# EAGLE schematic csa_gecko_v3.0c (EAGLE 4.16)
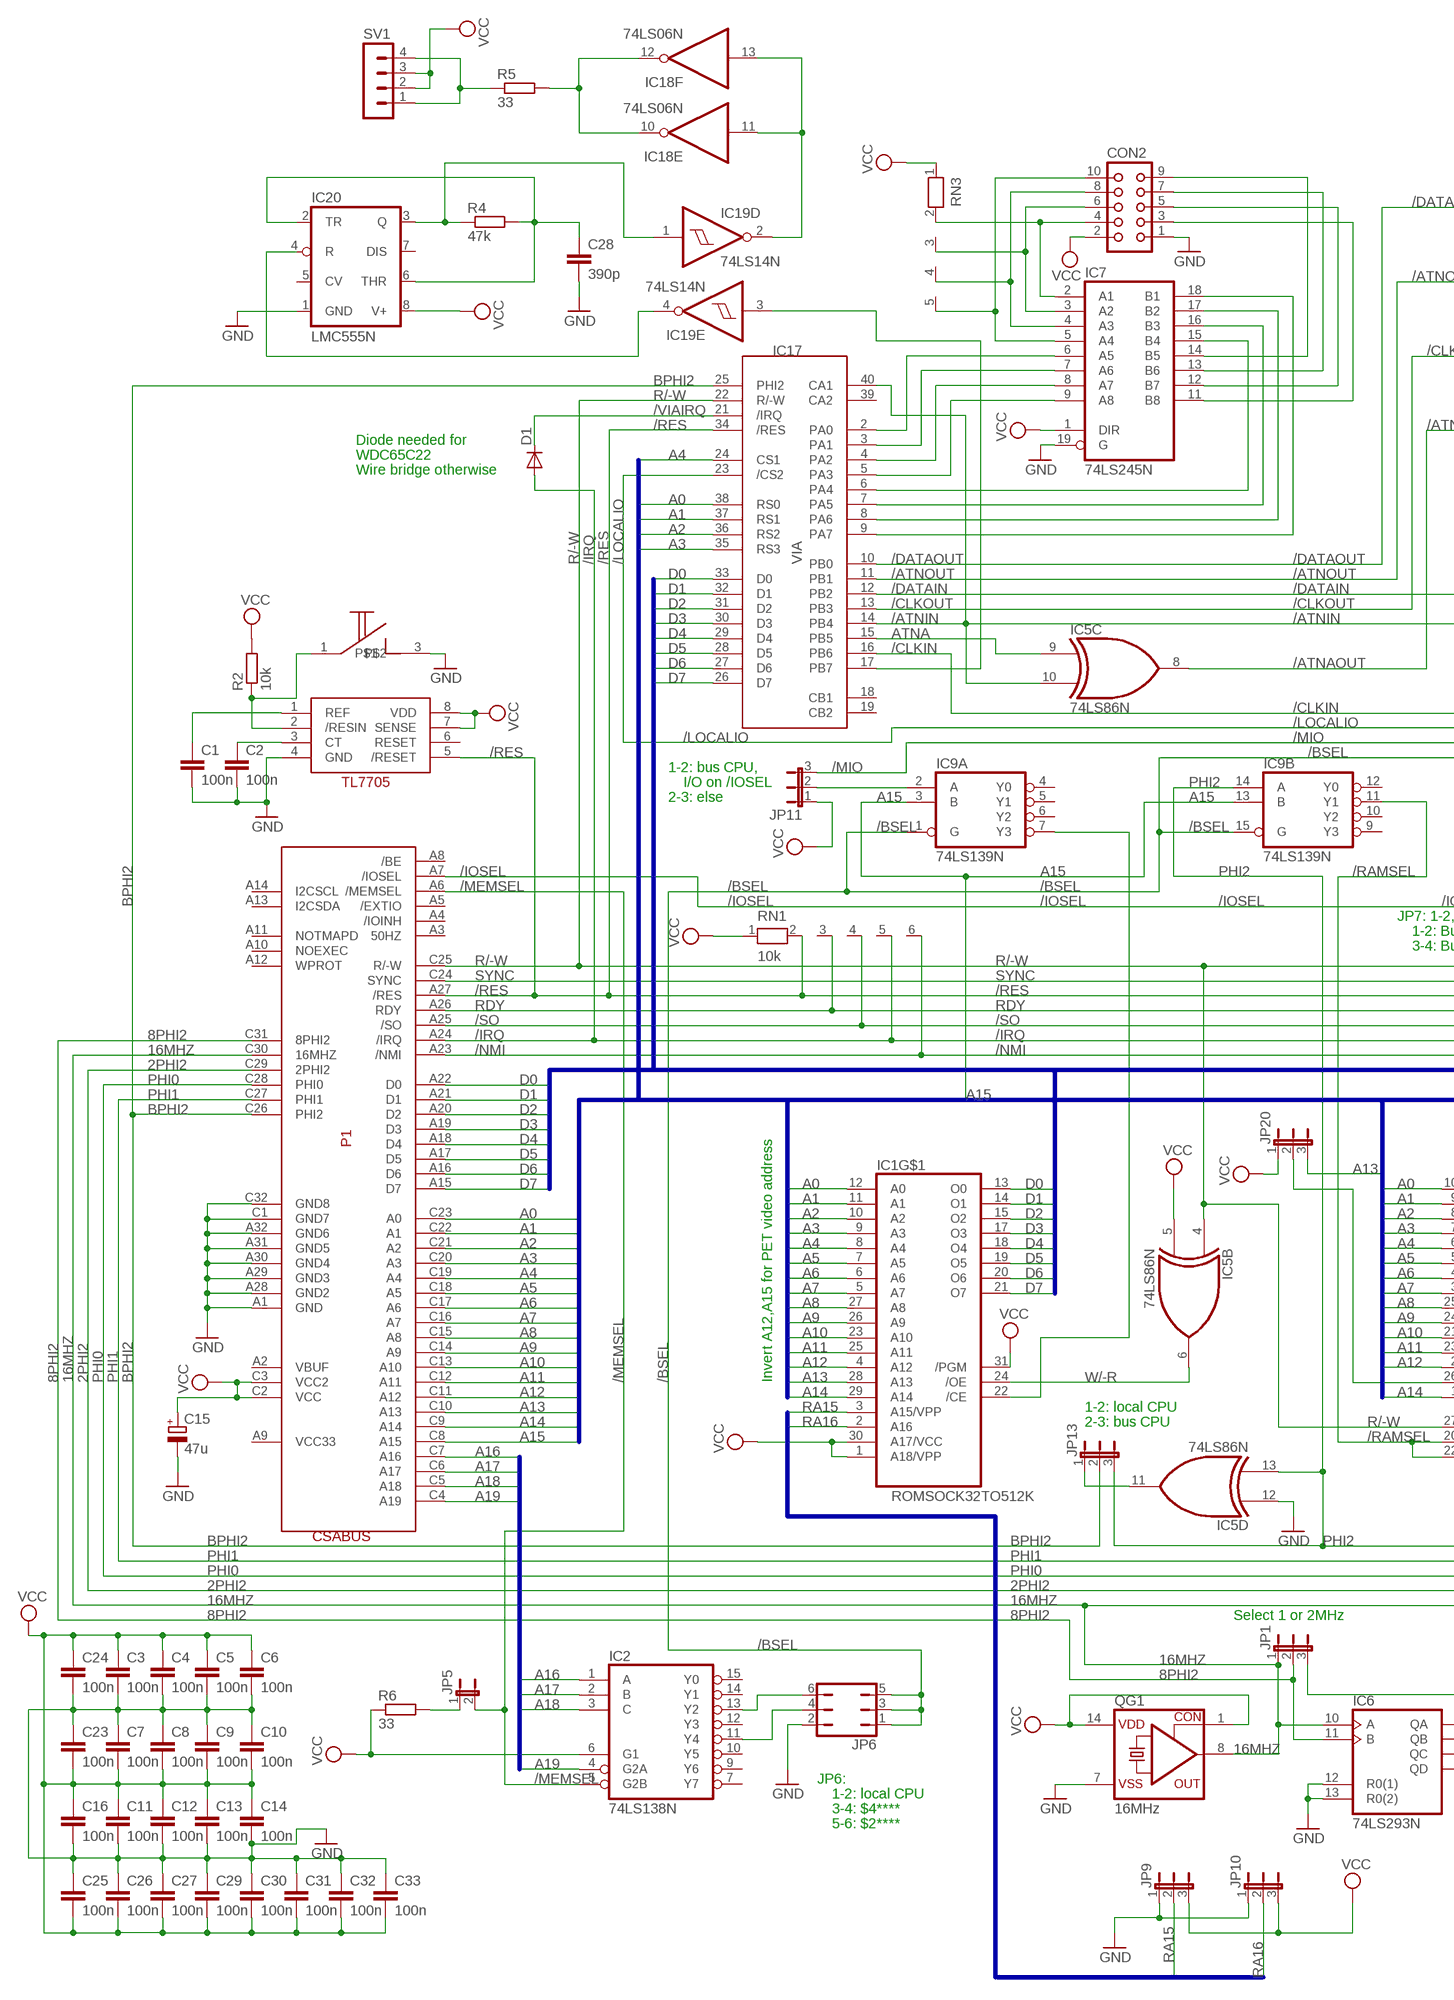
[diagram p0: schematic, sheet 1, part 1 of 2]
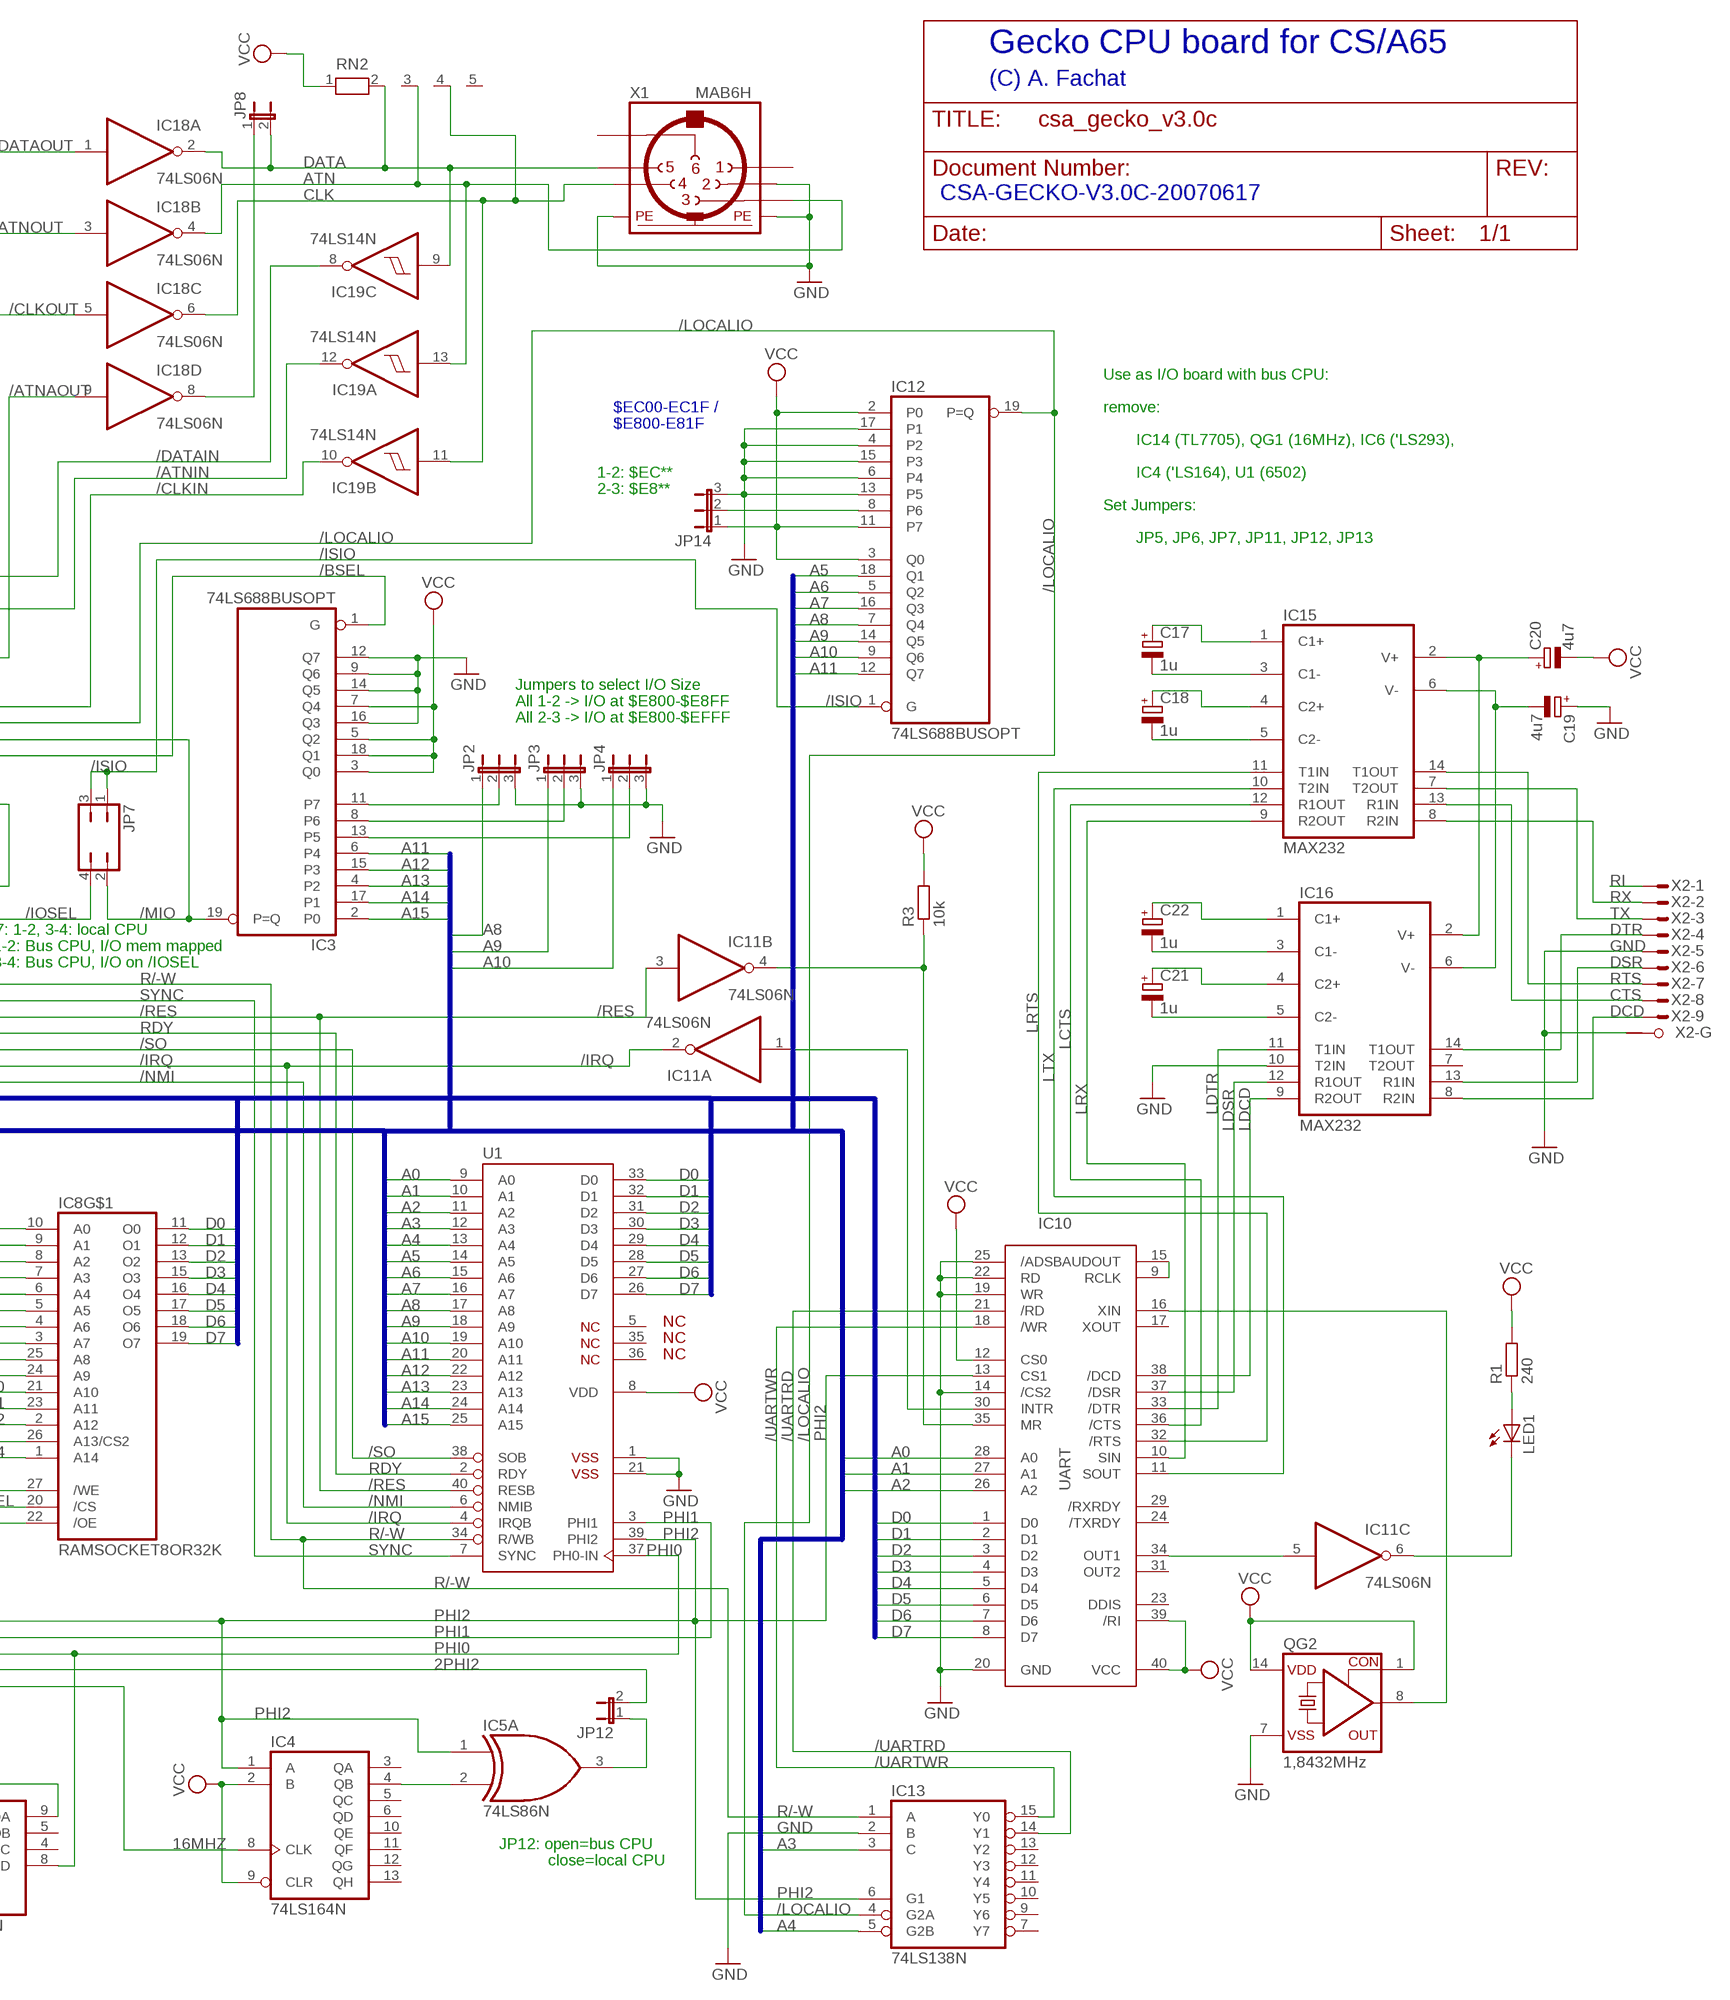
[diagram p1: schematic, sheet 1, part 2 of 2]

## Parts
C1  100n  C-EU025-025X050  [C025-025X050]
C2  100n  C-EU025-025X050  [C025-025X050]
C3  100n  C-EU025-025X050  [C025-025X050]
C4  100n  C-EU025-025X050  [C025-025X050]
C5  100n  C-EU025-025X050  [C025-025X050]
C6  100n  C-EU025-025X050  [C025-025X050]
C7  100n  C-EU025-025X050  [C025-025X050]
C8  100n  C-EU025-025X050  [C025-025X050]
C9  100n  C-EU025-025X050  [C025-025X050]
C10  100n  C-EU025-025X050  [C025-025X050]
C11  100n  C-EU025-025X050  [C025-025X050]
C12  100n  C-EU025-025X050  [C025-025X050]
C13  100n  C-EU025-025X050  [C025-025X050]
C14  100n  C-EU025-025X050  [C025-025X050]
C15  47u  CPOL-EUE2.5-5  [E2,5-5]
C16  100n  C-EU025-025X050  [C025-025X050]
C17  1u  CPOL-EUE2.5-6  [E2,5-6]
C18  1u  CPOL-EUE2.5-6  [E2,5-6]
C19  4u7  CPOL-EUE2.5-6  [E2,5-6]
C20  4u7  CPOL-EUE2.5-6  [E2,5-6]
C21  1u  CPOL-EUE2.5-6  [E2,5-6]
C22  1u  CPOL-EUE2.5-6  [E2,5-6]
C23  100n  C-EU025-025X050  [C025-025X050]
C24  100n  C-EU025-025X050  [C025-025X050]
C25  100n  C-EU025-025X050  [C025-025X050]
C26  100n  C-EU025-025X050  [C025-025X050]
C27  100n  C-EU025-025X050  [C025-025X050]
C28  390p  C-EU050-025X075  [C050-025X075]
C29  100n  C-EU025-025X050  [C025-025X050]
C30  100n  C-EU025-025X050  [C025-025X050]
C31  100n  C-EU025-025X050  [C025-025X050]
C32  100n  C-EU025-025X050  [C025-025X050]
C33  100n  C-EU025-025X050  [C025-025X050]
CON2  CON10  [CON10]
D1  DIODE-D-5  [D-5]
IC1  ROMSOCK32TO512K  [DIL32OPT28]
IC2  74LS138N  [DIL16]
IC3  74LS688BUSOPT  [DIL20]
IC4  74LS164N  [DIL14]
IC5  74LS86N  [DIL14]
IC6  74LS293N  [DIL14]
IC7  74LS245N  [DIL20]
IC8  RAMSOCKET8OR32K  [DIL28]
IC9  74LS139N  [DIL16]
IC10  UART  [DIL40]
IC11  74LS06N  [DIL14]
IC12  74LS688BUSOPT  [DIL20]
IC13  74LS138N  [DIL16]
IC14  TL7705  [DIL08]
IC15  MAX232  [DIL16]
IC16  MAX232  [DIL16]
IC17  VIA  [DIL40]
IC18  74LS06N  [DIL14]
IC19  74LS14N  [DIL14]
IC20  LMC555N  LM555N  [DIL08]
JP1  JP2E  [JP2]
JP2  JP2E  [JP2]
JP3  JP2E  [JP2]
JP4  JP2E  [JP2]
JP5  JP1E  [JP1]
JP6  JP3Q  [JP3Q]
JP7  JP2Q  [JP2Q]
JP8  JP1E  [JP1]
JP9  JP2E  [JP2]
JP10  JP2E  [JP2]
JP11  JP2E  [JP2]
JP12  JP1E  [JP1]
JP13  JP2E  [JP2]
JP14  JP2E  [JP2]
JP20  JP2E  [JP2]
LED1  LED3MM  [LED3MM]
P1  CSABUS  [CSABUS]
QG1  16MHz  CRYSTAL_RES-SG51  [SG51]
QG2  1,8432MHz  CRYSTAL_RES-SG51  [SG51]
R1  240  R-EU_0207/10  [0207/10]
R2  10k  R-EU_0207/10  [0207/10]
R3  10k  R-EU_0207/10  [0207/10]
R4  47k  R-EU_0204/7  [0204/7]
R5  33  R-EU_0204/7  [0204/7]
R6  33  R-EU_0204/7  [0204/7]
RN1  10k  RN05  [RN-6]
RN2  RN04  [RN-5]
RN3  RN04  [RN-5]
SV1  MA04-1  [MA04-1]
U1  G65SC02P  [DIP-40]
U$2  TASTER  [TASTER]
X1  MAB6H  [MAB6H]
X2  M09HPS  [M09HP]

## Nets
2PHI2: JP12.2 P1.C29(2PHI2)
8PHI2: IC6.11(B) JP1.2 P1.C31(8PHI2)
16MHZ: IC4.8(CLK) IC6.10(A) JP1.1 P1.C30(16MHZ) QG1.8(OUT)
/ATNAOUT: IC5.8(C:O) IC18.9(D:I)
/ATNIN: IC5.10(C:I1) IC17.14(PB4) IC17.40(CA1) IC19.12(A:O)
/ATNOUT: IC17.11(PB1) IC18.3(B:I)
/BSEL: IC3.1(G) IC9.1(A:G) IC9.15(B:G) JP6.1 JP6.3 JP6.5
/CLKIN: IC17.16(PB6) IC19.10(B:O)
/CLKOUT: IC17.13(PB3) IC18.5(C:I)
/DATAIN: IC17.12(PB2) IC19.8(C:O)
/DATAOUT: IC17.10(PB0) IC18.1(A:I)
/IOSEL: JP7.4 P1.A7(/IOSEL)
/IRQ: D1.A IC11.2(A:O) P1.A24(/IRQ) RN1.5 U1.4(IRQB)
/ISIO: IC12.1(G) JP7.1 JP7.3
/LOCALIO: IC12.19(P=Q) IC13.4(G2A) IC17.23(/CS2)
/MEMSEL: IC2.5(G2B) JP5.2 P1.A6(/MEMSEL)
/MIO: IC3.19(P=Q) JP7.2 JP11.3
/NMI: P1.A23(/NMI) RN1.6 U1.6(NMIB)
/RAMSEL: IC8.20(/CS) IC8.22(/OE) IC9.11(B:Y1)
/RES: IC11.3(B:I) IC14.5(/RESET) IC17.34(/RES) P1.A27(/RES) RN1.2 U1.40(RESB)
/SO: P1.A25(/SO) RN1.4 U1.38(SOB)
/UARTRD: IC10.21(/RD) IC13.14(Y1)
/UARTWR: IC10.18(/WR) IC13.15(Y0)
/VIAIRQ: D1.C IC17.21(/IRQ)
A0: IC1.12(A0) IC8.10(A0) IC10.28(A0) IC17.38(RS0) P1.C23(A0) U1.9(A0)
A1: IC1.11(A1) IC8.9(A1) IC10.27(A1) IC17.37(RS1) P1.C22(A1) U1.10(A1)
A2: IC1.10(A2) IC8.8(A2) IC10.26(A2) IC17.36(RS2) P1.C21(A2) U1.11(A2)
A3: IC1.9(A3) IC8.7(A3) IC13.3(C) IC17.35(RS3) P1.C20(A3) U1.12(A3)
A4: IC1.8(A4) IC8.6(A4) IC13.5(G2B) IC17.24(CS1) P1.C19(A4) U1.13(A4)
A5: IC1.7(A5) IC8.5(A5) IC12.18(Q1) P1.C18(A5) U1.14(A5)
A6: IC1.6(A6) IC8.4(A6) IC12.5(Q2) P1.C17(A6) U1.15(A6)
A7: IC1.5(A7) IC8.3(A7) IC12.16(Q3) P1.C16(A7) U1.16(A7)
A8: IC1.27(A8) IC8.25(A8) IC12.7(Q4) JP2.1 P1.C15(A8) U1.17(A8)
A9: IC1.26(A9) IC8.24(A9) IC12.14(Q5) JP3.1 P1.C14(A9) U1.18(A9)
A10: IC1.23(A10) IC8.21(A10) IC12.9(Q6) JP4.1 P1.C13(A10) U1.19(A10)
A11: IC1.25(A11) IC3.6(P4) IC8.23(A11) IC12.12(Q7) P1.C12(A11) U1.20(A11)
A12: IC1.4(A12) IC3.15(P3) IC8.2(A12) P1.C11(A12) U1.22(A12)
A13: IC1.28(A13) IC3.4(P2) JP20.3 P1.C10(A13) U1.23(A13)
A14: IC1.29(A14) IC3.17(P1) IC8.1(A14) P1.C9(A14) U1.24(A14)
A15: IC3.2(P0) IC9.3(A:B) IC9.13(B:B) P1.C8(A15) U1.25(A15)
A16: IC2.1(A) P1.C7(A16)
A17: IC2.2(B) P1.C6(A17)
A18: IC2.3(C) P1.C5(A18)
A19: IC2.4(G2A) P1.C4(A19)
ATN: IC18.4(B:O) IC19.13(A:I) RN2.3 X1.3
ATNA: IC5.9(C:I0) IC17.15(PB5)
BPHI2: IC17.25(PHI2) JP13.2 P1.C26(PHI2)
CLK: IC18.6(C:O) IC19.11(B:I) RN2.4 X1.4
CTS: IC15.13(R1IN) X2.8(-8:M)
D0: IC1.13(O0) IC8.11(O0) IC10.1(D0) IC17.33(D0) P1.A22(D0) U1.33(D0)
D1: IC1.14(O1) IC8.12(O1) IC10.2(D1) IC17.32(D1) P1.A21(D1) U1.32(D1)
D2: IC1.15(O2) IC8.13(O2) IC10.3(D2) IC17.31(D2) P1.A20(D2) U1.31(D2)
D3: IC1.17(O3) IC8.15(O3) IC10.4(D3) IC17.30(D3) P1.A19(D3) U1.30(D3)
D4: IC1.18(O4) IC8.16(O4) IC10.5(D4) IC17.29(D4) P1.A18(D4) U1.29(D4)
D5: IC1.19(O5) IC8.17(O5) IC10.6(D5) IC17.28(D5) P1.A17(D5) U1.28(D5)
D6: IC1.20(O6) IC8.18(O6) IC10.7(D6) IC17.27(D6) P1.A16(D6) U1.27(D6)
D7: IC1.21(O7) IC8.19(O7) IC10.8(D7) IC17.26(D7) P1.A15(D7) U1.26(D7)
DATA: IC18.2(A:O) IC19.9(C:I) JP8.2 RN2.2 X1.5
DCD: IC16.8(R2IN) X2.9(-9:M)
DSR: IC16.13(R1IN) X2.6(-6:M)
DTR: IC16.14(T1OUT) X2.4(-4:M)
GND: C1.2 C2.2 C3.2 C4.2 C5.2 C6.2 C7.1 C8.1 C9.1 C10.1 C11.2 C12.2 C13.2 C14.2 C15.- C16.2 C19.+ C23.1 C24.2 C25.1 C26.1 C27.1 C28.2 C29.1 C30.1 C31.1 C32.1 C33.1 CON2.1 IC3.9(Q6) IC3.12(Q7) IC3.14(Q5) IC3.16(Q3) IC5.12(D:I0) IC6.12(R0(1)) IC6.13(R0(2)) IC7.19(G) IC10.14(/CS2) IC10.19(WR) IC10.20(GND) IC10.22(RD) IC10.25(/ADS) IC12.4(P2) IC12.6(P4) IC12.13(P5) IC12.15(P3) IC12.17(P1) IC13.2(B) IC14.4(GND) IC16.10(T2IN) IC20.1(GND) JP2.3 JP3.3 JP4.3 JP6.2 JP9.1 JP10.1 JP14.3 P1.A1(GND) P1.A28(GND2) P1.A29(GND3) P1.A30(GND4) P1.A31(GND5) P1.A32(GND6) P1.C1(GND7) P1.C32(GND8) QG1.7(VSS) QG2.7(VSS) U1.1(VSS$1) U1.21(VSS$2) U$2.3 X1.2 X1.PE X1.PE@(PE) X2.5(-5:M) X2.G1(-G:G1)
LCTS: IC10.36(/CTS) IC15.12(R1OUT)
LDCD: IC10.38(/DCD) IC16.9(R2OUT)
LDSR: IC10.37(/DSR) IC16.12(R1OUT)
LDTR: IC10.33(/DTR) IC16.11(T1IN)
LRTS: IC10.32(/RTS) IC15.11(T1IN)
LRX: IC10.10(SIN) IC15.9(R2OUT)
LTX: IC10.11(SOUT) IC15.10(T2IN)
N$1: IC6.9(QA) JP1.3
N$2: C2.1 IC14.3(CT)
N$3: C1.1 IC14.1(REF)
N$4: IC4.4(QB) IC5.2(A:I1)
N$5: JP5.1 R6.2
N$6: IC3.11(P7) JP2.2
N$7: IC14.2(/RESIN) R2.1 U$2.1
N$8: IC1.22(/CE) IC9.7(A:Y3)
N$10: IC3.8(P6) JP3.2
N$11: IC3.13(P5) JP4.2
N$12: IC2.13(Y2) JP6.6
N$13: IC12.8(P6) JP14.2
N$14: IC2.11(Y4) JP6.4
N$16: IC5.3(A:O) JP12.1
N$17: IC7.6(A5) IC17.2(PA0)
N$18: IC8.26(A13/CS2) JP20.2
N$19: IC7.7(A6) IC17.3(PA1)
N$20: IC7.8(A7) IC17.4(PA2)
N$21: IC7.9(A8) IC17.5(PA3)
N$22: IC10.9(RCLK) IC10.15(BAUDOUT)
N$23: IC7.15(B4) IC17.6(PA4)
N$24: IC10.30(INTR) IC11.1(A:I)
N$25: IC7.16(B3) IC17.7(PA5)
N$26: IC7.17(B2) IC17.8(PA6)
N$27: IC9.2(A:A) JP11.2
N$29: IC5.11(D:O) JP13.1
N$32: IC7.18(B1) IC17.9(PA7)
N$33: LED1.A R1.1
N$34: IC10.34(OUT1) IC11.5(C:I)
N$35: IC11.6(C:O) LED1.K(C)
N$36: CON2.3 IC7.11(B8)
N$37: CON2.7 IC7.13(B6)
N$38: CON2.5 IC7.12(B7)
N$39: IC10.16(XIN) QG2.8(OUT)
N$40: CON2.9 IC7.14(B5)
N$41: C17.- IC15.3(C1-)
N$42: C17.+ IC15.1(C1+)
N$43: C22.- IC16.3(C1-)
N$44: C22.+ IC16.1(C1+)
N$45: C18.- IC15.5(C2-)
N$46: C18.+ IC15.4(C2+)
N$47: C21.- IC16.5(C2-)
N$48: C21.+ IC16.4(C2+)
N$49: C19.- IC15.6(V-) IC16.6(V-)
N$50: C20.+ IC15.2(V+) IC16.2(V+)
N$51: CON2.4 IC7.2(A1) RN3.2
N$52: CON2.6 IC7.3(A2) RN3.3
N$53: CON2.8 IC7.4(A3) RN3.4
N$54: CON2.10 IC7.5(A4) RN3.5
N$55: IC19.1(D:I) IC20.3(Q) R4.1
N$56: C28.1 IC20.2(TR) IC20.6(THR) R4.2
N$57: IC18.11(E:I) IC18.13(F:I) IC19.2(D:O)
N$58: IC18.10(E:O) IC18.12(F:O) R5.2
N$59: IC17.17(PB7) IC19.3(E:I)
N$60: IC19.4(E:O) IC20.4(R)
N$61: R5.1 SV1.1 SV1.4
N$66: IC18.8(D:O) JP8.1
PHI0: IC6.8(QD) P1.C28(PHI0) U1.37(PH0-IN)
PHI1: P1.C27(PHI1) U1.3(PHI1)
PHI2: IC4.1(A) IC5.1(A:I0) IC5.13(D:I1) IC9.14(B:A) IC10.13(CS1) IC13.6(G1) JP13.3 U1.39(PHI2)
R/-W: IC5.4(B:I0) IC8.27(/WE) IC13.1(A) IC17.22(R/-W) P1.C25(R/-W) U1.34(R/WB)
RA15: IC1.3(A15/VPP) JP9.2
RA16: IC1.2(A16) JP10.2
RDY: P1.A26(RDY) RN1.3 U1.2(RDY)
RI: X2.1(-1:M)
RTS: IC15.14(T1OUT) X2.7(-7:M)
RX: IC15.8(R2IN) X2.2(-2:M)
SYNC: P1.C24(SYNC) U1.7(SYNC)
TX: IC15.7(T2OUT) X2.3(-3:M)
UARTRES: IC10.35(MR) IC11.4(B:O) R3.1
VCC: C3.1 C4.1 C5.1 C6.1 C7.2 C8.2 C9.2 C10.2 C11.1 C12.1 C13.1 C14.1 C15.+ C16.1 C20.- C23.2 C24.1 C25.2 C26.2 C27.2 C29.2 C30.2 C31.2 C32.2 C33.2 CON2.2 IC1.1(A18/VPP) IC1.30(A17/VCC) IC1.31(/PGM) IC2.6(G1) IC3.3(Q0) IC3.5(Q2) IC3.7(Q4) IC3.18(Q1) IC4.2(B) IC4.9(CLR) IC5.5(B:I1) IC7.1(DIR) IC10.12(CS0) IC10.39(/RI) IC10.40(VCC) IC12.2(P0) IC12.3(Q0) IC12.11(P7) IC14.7(SENSE) IC14.8(VDD) IC20.8(V+) JP9.3 JP10.3 JP11.1 JP14.1 JP20.1 P1.C2(VCC) P1.C3(VCC2) QG1.1(CON) QG1.14(VDD) QG2.1(CON) QG2.14(VDD) R1.2 R2.2 R3.2 R6.1 RN1.1 RN2.1 RN3.1 SV1.2 SV1.3 U1.8(VDD)
W/-R: IC1.24(/OE) IC5.6(B:O)
Unconnected: IC2.7(Y7) IC2.9(Y6) IC2.10(Y5) IC2.12(Y3) IC2.14(Y1) IC2.15(Y0) IC4.3(QA) IC4.5(QC) IC4.6(QD) IC4.10(QE) IC4.11(QF) IC4.12(QG) IC4.13(QH) IC6.4(QC) IC6.5(QB) IC9.4(A:Y0) IC9.5(A:Y1) IC9.6(A:Y2) IC9.9(B:Y3) IC9.10(B:Y2) IC9.12(B:Y0) IC10.17(XOUT) IC10.23(DDIS) IC10.24(/TXRDY) IC10.29(/RXRDY) IC10.31(OUT2) IC11.8(D:O) IC11.9(D:I) IC11.10(E:O) IC11.11(E:I) IC11.12(F:O) IC11.13(F:I) IC13.7(Y7) IC13.9(Y6) IC13.10(Y5) IC13.11(Y4) IC13.12(Y3) IC13.13(Y2) IC14.6(RESET) IC16.7(T2OUT) IC17.18(CB1) IC17.19(CB2) IC17.39(CA2) IC19.5(F:I) IC19.6(F:O) IC20.5(CV) IC20.7(DIS) P1.A2(VBUF) P1.A3(50HZ) P1.A4(/IOINH) P1.A5(/EXTIO) P1.A8(/BE) P1.A9(VCC33) P1.A10(NOEXEC) P1.A11(NOTMAPD) P1.A12(WPROT) P1.A13(I2CSDA) P1.A14(I2CSCL) RN2.5 U1.5(NC$1) U1.35(NC$2) U1.36(NC$3) X1.1 X1.6 X2.G2(-G:G2)

## Buses
A[0..15]
D[0..7]
RA[15..18]
A[16..19]

## Notes on the sheet
- Gecko CPU board for CS/A65
- (C) A. Fachat
- CSA-GECKO-V3.0C-20070617
- Use as I/O board with bus CPU:
- Diode needed for | $EC00-EC1F / | remove:
- WDC65C22 | $E800-E81F
- Wire bridge otherwise | IC14 (TL7705), QG1 (16MHz), IC6 ('LS293),
- 1-2: $EC** | IC4 ('LS164), U1 (6502)
- 2-3: $E8**
- Set Jumpers:
- JP5, JP6, JP7, JP11, JP12, JP13
- Jumpers to select I/O Size
- All 1-2 -> I/O at $E800-$E8FF
- All 2-3 -> I/O at $E800-$EFFF
- 1-2: bus CPU,
- I/O on /IOSEL
- 2-3: else
- JP7: 1-2, 3-4: local CPU
- 1-2: Bus CPU, I/O mem mapped
- 3-4: Bus CPU, I/O on /IOSEL
- Invert A12,A15 for PET video address
- 1-2: local CPU
- 2-3: bus CPU
- Select 1 or 2MHz
- JP12: open=bus CPU
- close=local CPU
- JP6:
- 1-2: local CPU
- 3-4: $4****
- 5-6: $2****

## Power pins joined to a net without a drawn wire
GND: IC1.16(GND) IC2.8(GND) IC3.10(GND) IC4.7(GND) IC5.7(P:GND) IC6.7(GND) IC7.10(GND) IC8.14(GND) IC9.8(P:GND) IC11.7(P:GND) IC12.10(GND) IC13.8(GND) IC15.15(GND) IC16.15(GND) IC17.1(GND) IC18.7(P:GND) IC19.7(P:GND)
VCC: IC1.32(VCC) IC2.16(VCC) IC3.20(VCC) IC4.14(VCC) IC5.14(P:VCC) IC6.14(VCC) IC7.20(VCC) IC8.28(VCC) IC9.16(P:VCC) IC11.14(P:VCC) IC12.20(VCC) IC13.16(VCC) IC15.16(VCC) IC16.16(VCC) IC17.20(VCC) IC18.14(P:VCC) IC19.14(P:VCC)

## Library data of the parts
C1-C14 C16 C23-C33 = rcl:C-EU: CAPACITOR, European symbol
C15 C17-C22 = rcl:CPOL-EU: POLARIZED CAPACITOR, European symbol
CON2 = con-harting:CON10: CONNECTOR
D1 = diode:DIODE-: DIODE
IC1 = csa:ROMSOCK32TO512K
IC2 IC13 = 74xx-eu:74*138: 3-line to 8-line DECODER/DEMULTIPLEXER
IC3 IC12 = csa:74LS688BUSOPT
IC4 = 74xx-eu:74*164: 8-bit parallel out SHIFT REGISTER
IC5 = 74xx-us:74*86: Quad 2-input EXCLUSIV-OR (XOR) gate
IC6 = 74xx-eu:74*293: Decade and 4-bit BINARY COUNTER
IC7 = 74xx-eu:74*245: Octal BUS TRANSCEIVER, 3-state
IC8 = csa:RAMSOCKET8OR32K
IC9 = 74xx-eu:74*139: Dual 2-line to 4-line DECODER/DEMULTIPLEXER
IC10 = csa:UART
IC11 IC18 = 74xx-eu:74*06: Hex INVERTER, open collector high-voltage output
IC14 = csa:TL7705
IC15 IC16 = maxim:MAX232: RS232 TRANSEIVER
IC17 = csa:VIA
IC19 = 74xx-eu:74*14: Hex schmitt trigger INVERTER
IC20 = linear:*555: TIMER
JP1-JP4 JP9-JP11 JP13 JP14 JP20 = jumper:JP2E: JUMPER
JP5 JP8 JP12 = jumper:JP1E: JUMPER
JP6 = jumper:JP3Q: JUMPER
JP7 = jumper:JP2Q: JUMPER
LED1 = led:LED: LED OSRAM: - CHIPLED LG R971, LG N971, LY N971, LG Q971, LY Q971, LO R971, LY R971 LH N974, LH R974 LS Q976, LO Q976, LY Q976 LO Q996 - Hyper CHIPLED LW Q18S LB Q993, LB Q99A, LB R99A - SideLED LS A670, LO A670, LY A670, LG A670, LP A670 LB A673, LV A673, LT A673, LW A673 LH A674 LY A675 LS A676, LA A676, LO A676, LY A676, LW A676 LS A679, LY A679, LG A679 - Hyper Micro SIDELED® LS Y876, LA Y876, LO Y876, LY Y876 LT Y87S - SmartLED LW L88C, LW L88S LB L89C, LB L89S, LG L890 LS L89K, LO L89K, LY L89K LS L896, LA L896, LO L896, LY L896 - TOPLED LS T670, LO T670, LY T670, LG T670, LP T670 LSG T670, LSP T670, LSY T670, LOP T670, LYG T670 LG T671, LOG T671, LSG T671 LB T673, LV T673, LT T673, LW T673 LH T674 LS T676, LA T676, LO T676, LY T676, LB T676, LH T676, LSB T676, LW T676 LB T67C, LV T67C, LT T67C, LS T67K, LO T67K, LY T67K, LW E67C LS E67B, LA E67B, LO E67B, LY E67B, LB E67C, LV E67C, LT E67C LW T67C LS T679, LY T679, LG T679 LS T770, LO T770, LY T770, LG T770, LP T770 LB T773, LV T773, LT T773, LW T773 LH T774 LS E675, LA E675, LY E675, LS T675 LS T776, LA T776, LO T776, LY T776, LB T776 LHGB T686 LT T68C, LB T68C - Hyper Mini TOPLED® LB M676 - Mini TOPLED Santana® LG M470 LS M47K, LO M47K, LY M47K Source: http://www.osram.convergy.de/
P1 = csa:CSABUS
QG1 QG2 = crystal:CRYSTAL_RES-: CRYSTAL RESONATOR
R1-R6 = rcl:R-EU_: RESISTOR, European symbol
RN1 = resistor-net:RN05: RESISTOR NETWORK
RN2 RN3 = resistor-net:RN04: RESISTOR NETWORK
SV1 = con-lstb:MA04-1: PIN HEADER
U1 = 65xxx:G65SC02P: California Micro Devices Version
U$2 = csa:TASTER
X1 = con-hirschmann:MAB6H: Female CONNECTOR 6 pins with shield, horizontal (DIN 45322)
X2 = con-subd:M09HPS: SUB-D